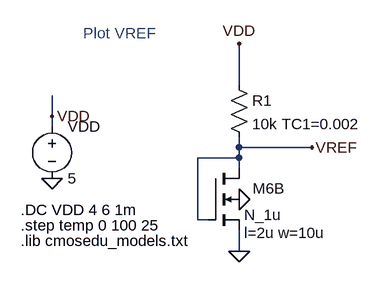
[diagram p0: schematic Fig23_5.asc]
Fig23_5.asc, the LTspice schematic file:
Version 4
SHEET 1 1784 680
WIRE 1088 -48 1088 -80
WIRE 1088 -32 1088 -48
WIRE 1312 112 1312 16
WIRE 1328 112 1312 112
WIRE 1376 -96 1376 -160
WIRE 1376 0 1376 -16
WIRE 1376 16 1312 16
WIRE 1376 16 1376 0
WIRE 1376 32 1376 16
WIRE 1376 160 1376 128
WIRE 1488 0 1376 0
FLAG 1088 48 0
FLAG 1088 -48 VDD
FLAG 1376 80 0
FLAG 1376 160 0
FLAG 1376 -160 VDD
FLAG 1488 0 VREF
SYMBOL voltage 1088 -48 R0
WINDOW 123 0 0 Left 0
WINDOW 39 0 0 Left 0
SYMATTR InstName VDD
SYMATTR Value 5
SYMBOL nmos4 1328 32 R0
WINDOW 123 56 100 Left 0
WINDOW 0 69 31 Left 0
SYMATTR Value2 l=2u w=10u
SYMATTR InstName M6B
SYMATTR Value N_1u
SYMBOL res 1360 -112 R0
SYMATTR InstName R1
SYMATTR Value 10k TC1=0.002
TEXT 1040 144 Left 0 !.lib cmosedu_models.txt
TEXT 1136 -176 Left 0 ;Plot VREF
TEXT 1040 96 Left 0 !.DC VDD 4 6 1m
TEXT 1040 120 Left 0 !.step temp 0 100 25

The netlist it stands for:
* Fig23_5.asc
VDD VDD 0 5
M6B VREF VREF 0 0 N_1u l=2u w=10u
R1 VDD VREF 10k TC1=0.002
.model NMOS NMOS
.model PMOS PMOS
.lib standard.mos
.lib cmosedu_models.txt
* Plot VREF
.DC VDD 4 6 1m
.step temp 0 100 25
.backanno
.end